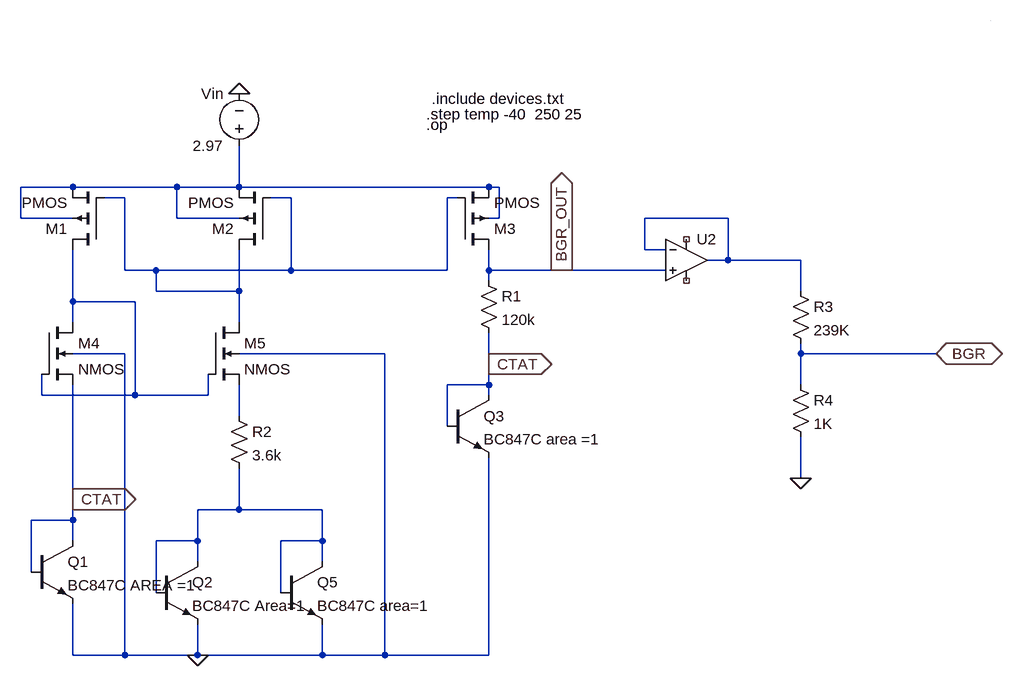
[diagram p0: schematic vref_band _project.asc]
vref_band _project.asc, the LTspice schematic file:
Version 4
SHEET 1 2412 1036
WIRE 208 160 128 160
WIRE 368 160 208 160
WIRE 464 160 464 96
WIRE 464 160 368 160
WIRE 848 160 464 160
WIRE 864 160 848 160
WIRE 288 176 256 176
WIRE 544 176 512 176
WIRE 800 176 784 176
WIRE 128 208 128 160
WIRE 208 208 128 208
WIRE 368 208 368 160
WIRE 464 208 368 208
WIRE 864 208 864 160
WIRE 864 208 848 208
WIRE 1216 208 1088 208
WIRE 1088 256 1088 208
WIRE 1120 256 1088 256
WIRE 1216 272 1216 208
WIRE 1216 272 1184 272
WIRE 1328 272 1216 272
WIRE 288 288 288 176
WIRE 336 288 288 288
WIRE 544 288 544 176
WIRE 544 288 336 288
WIRE 784 288 784 176
WIRE 784 288 544 288
WIRE 848 288 848 256
WIRE 960 288 848 288
WIRE 1120 288 960 288
WIRE 848 304 848 288
WIRE 336 320 336 288
WIRE 464 320 464 256
WIRE 464 320 336 320
WIRE 1328 320 1328 272
WIRE 208 336 208 256
WIRE 304 336 208 336
WIRE 208 368 208 336
WIRE 464 368 464 320
WIRE 288 416 208 416
WIRE 688 416 464 416
WIRE 1328 416 1328 400
WIRE 1536 416 1328 416
WIRE 848 432 848 384
WIRE 848 464 848 432
WIRE 848 464 784 464
WIRE 1328 464 1328 416
WIRE 160 480 160 448
WIRE 304 480 304 336
WIRE 304 480 160 480
WIRE 416 480 416 448
WIRE 416 480 304 480
WIRE 848 480 848 464
WIRE 464 512 464 464
WIRE 784 528 784 464
WIRE 1328 608 1328 544
WIRE 208 640 208 464
WIRE 464 656 464 592
WIRE 464 656 400 656
WIRE 592 656 464 656
WIRE 208 672 208 640
WIRE 208 672 144 672
WIRE 208 704 208 672
WIRE 400 704 400 656
WIRE 400 704 336 704
WIRE 592 704 592 656
WIRE 592 704 528 704
WIRE 400 736 400 704
WIRE 592 736 592 704
WIRE 144 752 144 672
WIRE 336 784 336 704
WIRE 528 784 528 704
WIRE 208 880 208 800
WIRE 288 880 288 416
WIRE 288 880 208 880
WIRE 400 880 400 832
WIRE 400 880 288 880
WIRE 592 880 592 832
WIRE 592 880 400 880
WIRE 688 880 688 416
WIRE 688 880 592 880
WIRE 848 880 848 576
WIRE 848 880 688 880
FLAG 400 880 0
FLAG 464 16 0
FLAG 1328 608 0
FLAG 1536 416 BGR
IOPIN 1536 416 BiDir
FLAG 208 640 CTAT
IOPIN 208 640 Out
FLAG 960 288 BGR_OUT
IOPIN 960 288 Out
FLAG 848 432 CTAT
IOPIN 848 432 Out
SYMBOL nmos4 160 368 R0
SYMATTR InstName M4
SYMATTR Value2 m=1
SYMBOL nmos4 416 368 R0
SYMATTR InstName M5
SYMATTR Value2 m=1
SYMBOL npn 144 704 R0
SYMATTR InstName Q1
SYMATTR Value BC847C AREA =1
SYMBOL npn 336 736 R0
SYMATTR InstName Q2
SYMATTR Value BC847C Area=1
SYMBOL Voltage 464 112 R180
WINDOW 0 24 96 Left 2
WINDOW 3 24 16 Left 2
SYMATTR InstName Vin
SYMATTR Value 2.97
SYMBOL Res 832 288 R0
SYMATTR InstName R1
SYMATTR Value 120k
SYMBOL Res 448 496 R0
SYMATTR InstName R2
SYMATTR Value 3.6k
SYMBOL npn 528 736 R0
SYMATTR InstName Q5
SYMATTR Value BC847C area=1
SYMBOL npn 784 480 R0
SYMATTR InstName Q3
SYMATTR Value BC847C area =1
SYMBOL Res 1312 304 R0
SYMATTR InstName R3
SYMATTR Value 239K
SYMBOL Res 1312 448 R0
SYMATTR InstName R4
SYMATTR Value 1K
SYMBOL OpAmps/UniversalOpAmp 1152 272 R0
SYMATTR InstName U2
SYMBOL pmos4 256 256 R180
SYMATTR InstName M1
SYMBOL pmos4 512 256 R180
SYMATTR InstName M2
SYMBOL pmos4 800 256 M180
SYMATTR InstName M3
TEXT 752 64 Left 2 !.op
TEXT 752 48 Left 2 !.step temp -40  250 25
TEXT 760 24 Left 2 !.include devices.txt
LINE Normal 1620 -96 1620 -96 2

The netlist it stands for:
* vref_band _project.asc
M4 N004 N004 CTAT 0 NMOS m=1
M5 N002 N004 N005 0 NMOS m=1
Q1 CTAT CTAT 0 0 BC847C AREA =1
Q2 N006 N006 0 0 BC847C Area=1
Vin N001 0 2.97
R1 BGR_OUT CTAT 120k
R2 N005 N006 3.6k
Q5 N006 N006 0 0 BC847C area=1
Q3 CTAT CTAT 0 0 BC847C area =1
R3 N003 BGR 239K
R4 BGR 0 1K
XU2 BGR_OUT N003 NC_01 NC_02 N003 level1 Avol=1Meg GBW=10Meg Vos=0 En=0 Enk=0 In=0 Ink=0 Rin=500Meg  ; pins In+ In- V+ V- OUT
M1 N004 N002 N001 N001 PMOS
M2 N002 N002 N001 N001 PMOS
M3 BGR_OUT N002 N001 N001 PMOS
.model NPN NPN
.model PNP PNP
.lib standard.bjt
.model NMOS NMOS
.model PMOS PMOS
.lib standard.mos
.op
.step temp -40  250 25
.include devices.txt
.lib UniversalOpAmp1.lib
.backanno
.end